# EAGLE design mariokard_v1_JX (EAGLE 7.2.0)
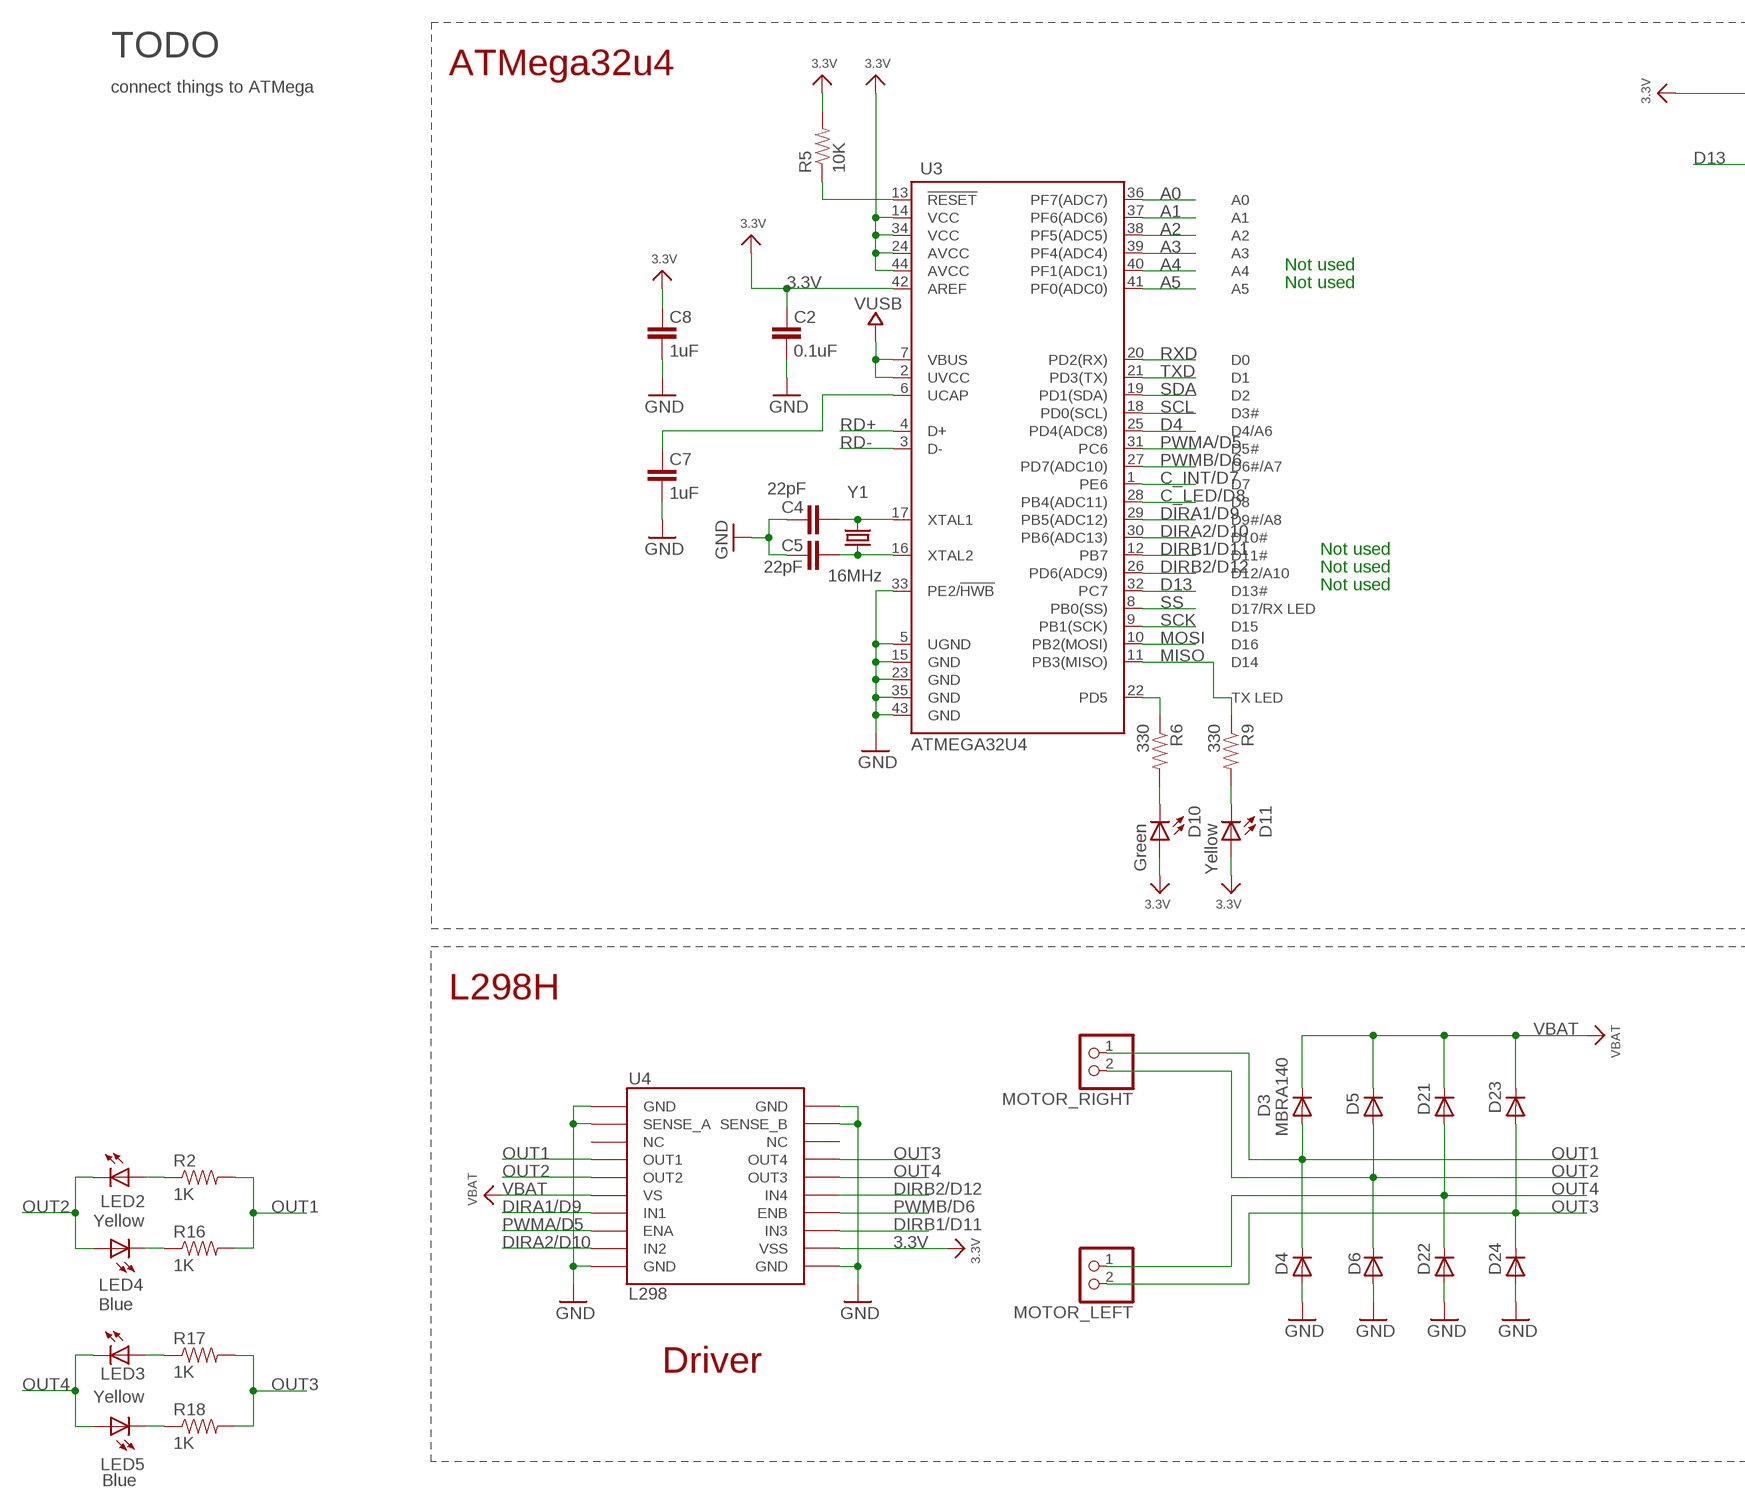
[diagram p0: schematic, sheet 1, part 1 of 2]
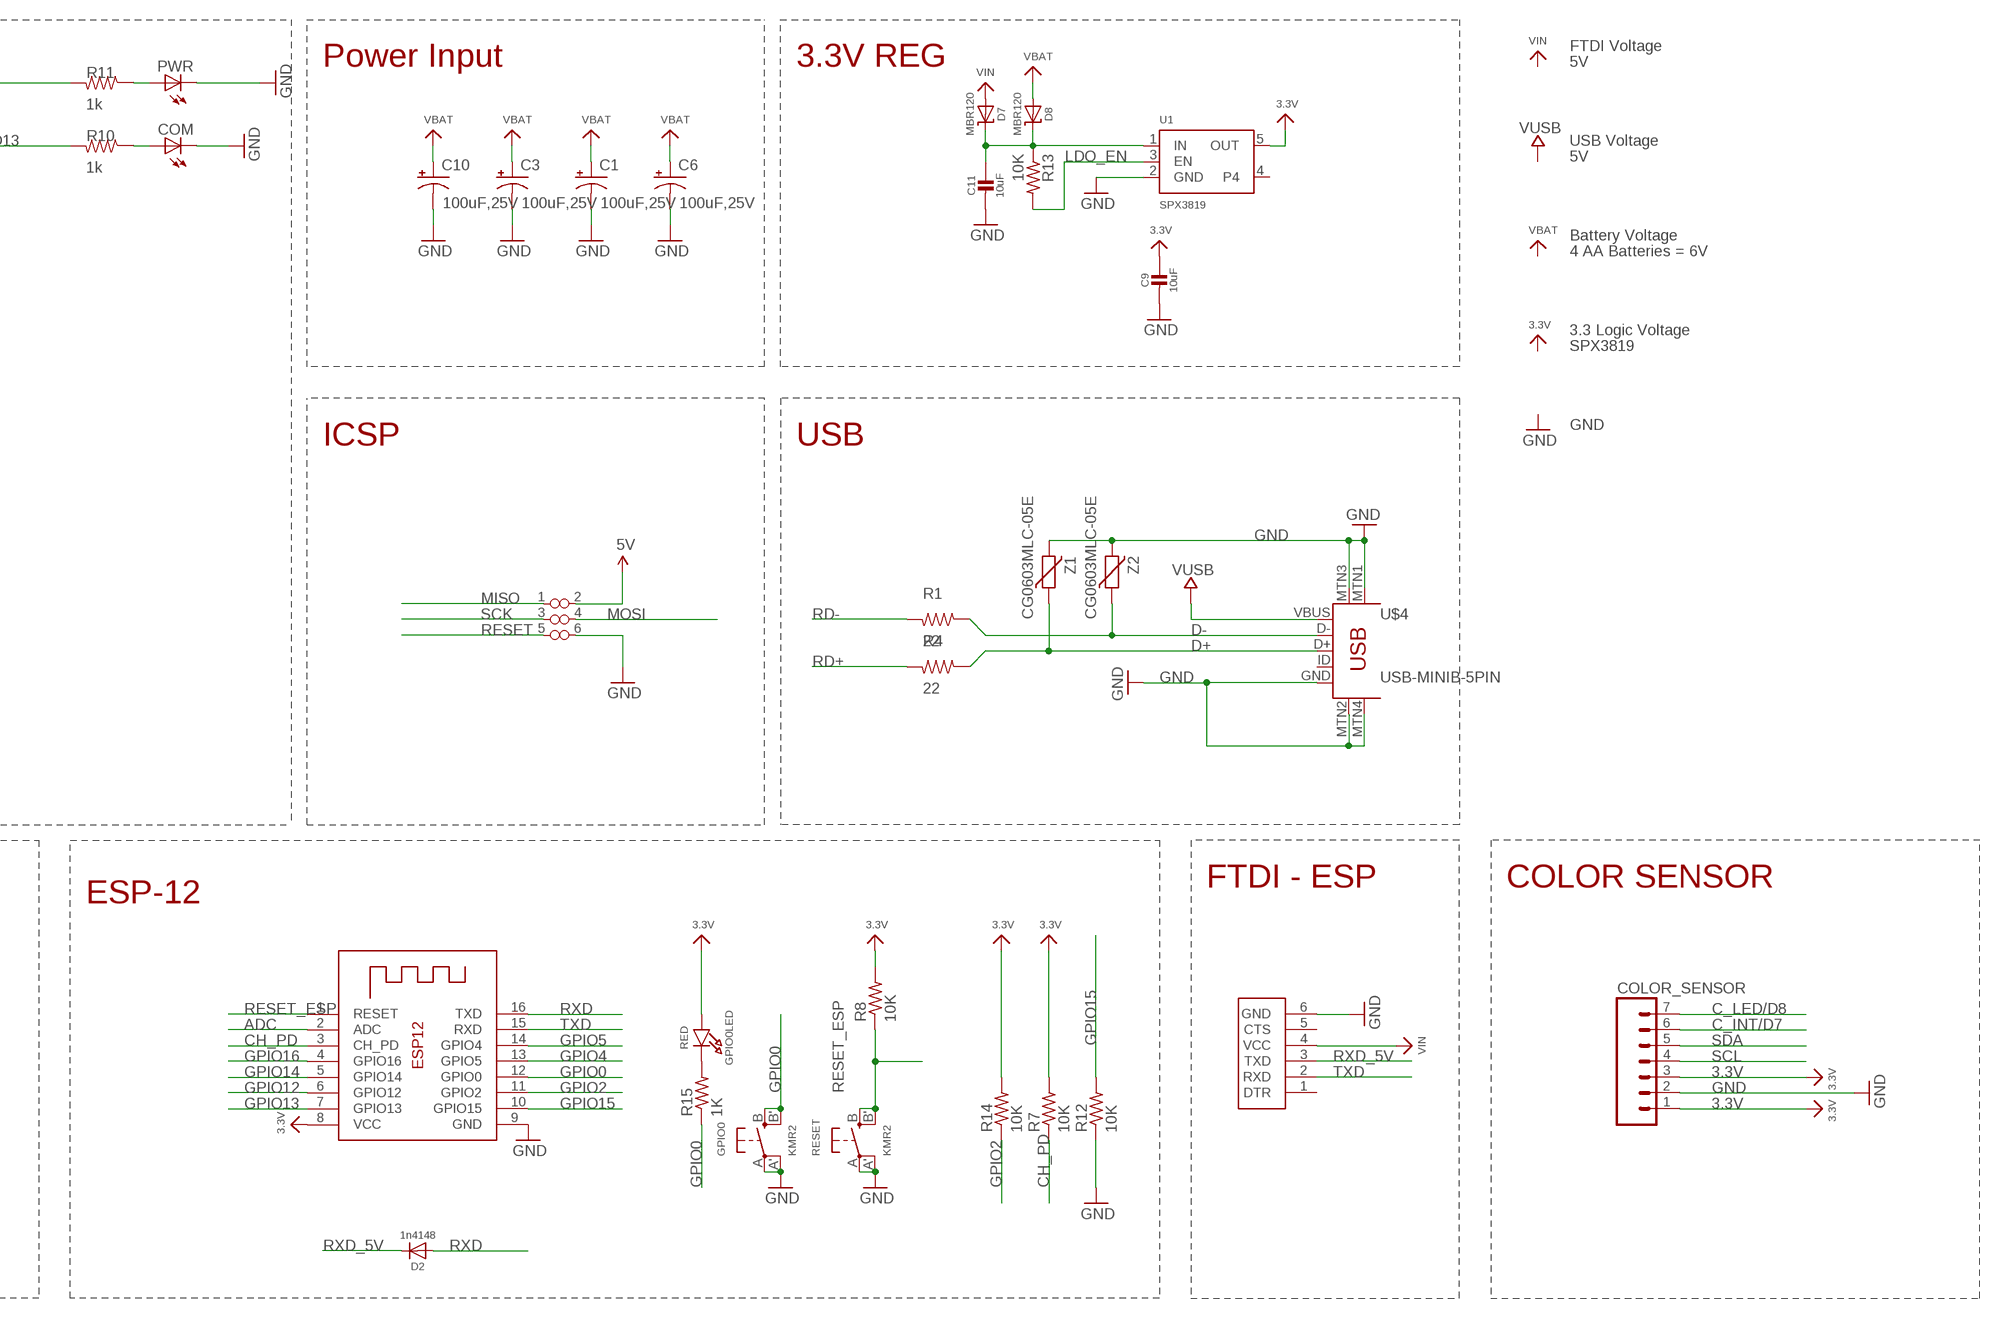
[diagram p1: schematic, sheet 1, part 2 of 2]

## Parts
C1  100uF,25V  CAP_POLF80  [NIPPON_F80]
C2  0.1uF  CAP0603-CAP  [0603-CAP]
C3  100uF,25V  CAP_POLF80  [NIPPON_F80]
C4  22pF  CAP0603-CAP  [0603-CAP]
C5  22pF  CAP0603-CAP  [0603-CAP]
C6  100uF,25V  CAP_POLF80  [NIPPON_F80]
C7  1uF  CAP0603-CAP  [0603-CAP]
C8  1uF  CAP0603-CAP  [0603-CAP]
C9  10uF  CAP_CERAMIC0805-NOOUTLINE  [0805-NO]
C10  100uF,25V  CAP_POLF80  [NIPPON_F80]
C11  10uF  CAP_CERAMIC0805-NOOUTLINE  [0805-NO]
COLOR_SENSOR  M07  [1X07]
COM  LEDCHIPLED_0603  [CHIPLED_0603]
D2  1n4148  DIODESOD-323  [SOD-323]
D3  MBRA140  DIODESMA  [SMA-DIODE]
D4  MBRA140  DIODESMA  [SMA-DIODE]
D5  MBRA140  DIODESMA  [SMA-DIODE]
D6  MBRA140  DIODESMA  [SMA-DIODE]
D7  MBR120  DIODE-SCHOTTKYSOD-123  [SOD-123]
D8  MBR120  DIODE-SCHOTTKYSOD-123  [SOD-123]
D10  Green  LED0603  [LED-0603]
D11  Yellow  LED0603  [LED-0603]
D21  MBRA140  DIODESMA  [SMA-DIODE]
D22  MBRA140  DIODESMA  [SMA-DIODE]
D23  MBRA140  DIODESMA  [SMA-DIODE]
D24  MBRA140  DIODESMA  [SMA-DIODE]
FTDI  FTDI_POGO  [FTDI_POGO]
GPIO0  KMR2  SWITCH_TACT_SMT4.6X2.8  [BTN_KMR2_4.6X2.8]
GPIO0LED  RED  LED0805_NOOUTLINE  [CHIPLED_0805_NOOUTLINE]
ISP  ISP_POGO  [POGO_ISP]
LED2  Yellow  LED0603  [LED-0603]
LED3  Yellow  LED0603  [LED-0603]
LED4  Blue  LED0603  [LED-0603]
LED5  Blue  LED0603  [LED-0603]
MOTOR_LEFT  JST_2PIN-SMT-RA  [JST-PH-2-SMT-RA]
MOTOR_RIGHT  JST_2PIN-SMT-RA  [JST-PH-2-SMT-RA]
PWR  LEDCHIPLED_0603  [CHIPLED_0603]
R1  22  RESISTOR0805-RES  [0805]
R2  1K  RESISTOR0402-RES  [0402-RES]
R4  22  RESISTOR0805-RES  [0805]
R5  10K  RESISTOR0603-RES  [0603-RES]
R6  330  RESISTOR0603-RES  [0603-RES]
R7  10K  R-US_R0603  [R0603]
R8  10K  R-US_R0603  [R0603]
R9  330  RESISTOR0603-RES  [0603-RES]
R10  1k  RESISTOR0805-RES  [0805]
R11  1k  RESISTOR0805-RES  [0805]
R12  10K  R-US_R0603  [R0603]
R13  10K  R-US_R0603  [R0603]
R14  10K  R-US_R0603  [R0603]
R15  1K  R-US_R0603  [R0603]
R16  1K  RESISTOR0402-RES  [0402-RES]
R17  1K  RESISTOR0402-RES  [0402-RES]
R18  1K  RESISTOR0402-RES  [0402-RES]
RESET  KMR2  SWITCH_TACT_SMT4.6X2.8  [BTN_KMR2_4.6X2.8]
U1  SPX3819  VREG_SOT23-5  [SOT23-5]
U3  ATMEGA32U4  ATMEGA32U4TQFP-44  [TQFP44]
U4  L298  L298_BRIDGE_DRIVER  [POWERSO20]
U$4  USB-MINIB-5PIN  [USB-MINIB]
X1  ESP-12  [ESP-12]
Y1  16MHz  CRYSTAL5X3  [CRYSTAL-SMD-5X3]
Z1  CG0603MLC-05E  VARISTORCN0603  [CT/CN0603]
Z2  CG0603MLC-05E  VARISTORCN0603  [CT/CN0603]

## Nets
3.3V: C2.2 C8.2 C9.1 COLOR_SENSOR.1 COLOR_SENSOR.3 D10.A D11.A GPIO0LED.A R5.2 R7.2 R8.2 R11.2 R14.2 U1.5(OUT) U3.14(VCC) U3.24(AVCC) U3.34(VCC) U3.42(AREF) U3.44(AVCC) U4.P$12(VSS) X1.8(VCC)
A0: U3.36(PF7(ADC7))
A1: U3.37(PF6(ADC6))
A2: U3.38(PF5(ADC5))
A3: U3.39(PF4(ADC4))
A4: U3.40(PF1(ADC1))
A5: U3.41(PF0(ADC0))
ADC: X1.2(ADC)
C_INT/D7: COLOR_SENSOR.6 U3.1(PE6)
C_LED/D8: COLOR_SENSOR.7 U3.28(PB4(ADC11))
CH_PD: R7.1 X1.3(CH_PD)
D4: U3.25(PD4(ADC8))
D13: R10.2 U3.32(PC7)
D+: R4.1 U$4.D+ Z1.1
D-: R1.1 U$4.D- Z2.1
DIRA1/D9: U3.29(PB5(ADC12)) U4.P$7(IN1)
DIRA2/D10: U3.30(PB6(ADC13)) U4.P$9(IN2)
DIRB1/D11: U3.12(PB7) U4.P$13(IN3)
DIRB2/D12: U3.26(PD6(ADC9)) U4.P$15(IN4)
GND: C1.- C2.1 C3.- C4.2 C5.2 C6.- C7.1 C8.1 C9.2 C10.- C11.2 COLOR_SENSOR.2 COM.C D4.A D6.A D22.A D24.A FTDI.6(GND) GPIO0.A'(P1) GPIO0.A(P) PWR.C R12.1 RESET.A'(P1) RESET.A(P) U1.2(GND) U3.5(UGND) U3.15(GND) U3.23(GND) U3.33(PE2/!HWB) U3.35(GND) U3.43(GND) U4.P$1(GND) U4.P$2(SENSE_A) U4.P$10(GND) U4.P$11(GND) U4.P$19(SENSE_B) U4.P$20(GND) U$4.GND U$4.MTN1(MTN2) U$4.MTN2(MTN3) U$4.MTN3(MTN1) U$4.MTN4 X1.9(GND) Z1.2 Z2.2
GPIO0: GPIO0.B'(S1) GPIO0.B(S) R15.1 X1.12(GPIO0)
GPIO2: R14.1 X1.11(GPIO2)
GPIO4: X1.13(GPIO5)
GPIO5: X1.14(GPIO4)
GPIO12: X1.6(GPIO12)
GPIO13: X1.7(GPIO13)
GPIO14: X1.5(GPIO14)
GPIO15: R12.2 X1.10(GPIO15)
GPIO16: X1.4(GPIO16)
LDO_EN: R13.2 U1.3(EN)
MISO: ISP.1(MISO) R9.1 U3.11(PB3(MISO))
MOSI: ISP.4(MOSI) U3.10(PB2(MOSI))
N$1: C5.1 U3.16(XTAL2) Y1.1
N$2: C4.1 U3.17(XTAL1) Y1.3
N$3: C7.2 U3.6(UCAP)
N$4: C11.1 D7.C D8.C R13.1 U1.1(IN)
N$5: LED2.A R2.1
N$6: LED4.C R16.1
N$7: LED5.C R18.1
N$8: LED3.A R17.1
N$9: COM.A R10.1
N$10: PWR.A R11.1
N$11: GPIO0LED.C R15.2
N$13: D11.C R9.2
N$14: D10.C R6.2
N$32: ISP.2(VCC) ; supply symbol labelled 5V
N$33: ISP.6(GND) ; supply symbol labelled GND
OUT1: D3.A D4.C MOTOR_RIGHT.1 R2.2 R16.2 U4.P$4(OUT1)
OUT2: D5.A D6.C LED2.C LED4.A MOTOR_RIGHT.2 U4.P$5(OUT2)
OUT3: D23.A D24.C MOTOR_LEFT.2 R17.2 R18.2 U4.P$17(OUT4)
OUT4: D21.A D22.C LED3.C LED5.A MOTOR_LEFT.1 U4.P$16(OUT3)
PWMA/D5: U3.31(PC6) U4.P$8(ENA)
PWMB/D6: U3.27(PD7(ADC10)) U4.P$14(ENB)
RD+: R4.2 U3.4(D+)
RD-: R1.2 U3.3(D-)
RESET: ISP.5(RESET) R5.1 U3.13(!RESET)
RESET_ESP: R8.1 RESET.B'(S1) RESET.B(S) X1.1(RESET)
RXD: D2.A U3.20(PD2(RX)) X1.16(TXD)
RXD_5V: D2.C FTDI.3(TXD)
SCK: ISP.3(SCK) U3.9(PB1(SCK))
SCL: COLOR_SENSOR.4 U3.18(PD0(SCL))
SDA: COLOR_SENSOR.5 U3.19(PD1(SDA))
SS: U3.8(PB0(SS))
TXD: FTDI.2(RXD) U3.21(PD3(TX)) X1.15(RXD)
TXLED1: R6.1 U3.22(PD5)
VBAT: C1.+ C3.+ C6.+ C10.+ D3.C D5.C D8.A D21.C D23.C U4.P$6(VS)
VIN: D7.A FTDI.4(VCC)
VUSB: U3.2(UVCC) U3.7(VBUS) U$4.VBUS
Unconnected: FTDI.1(DTR) FTDI.5(CTS) U1.4 U4.P$3(NC) U4.P$18(NC) U$4.ID

## Notes on the sheet
- TODO | FTDI Voltage
- ATMega32u4 | Power Input | 3.3V REG | 5V
- connect things to ATMega
- USB Voltage
- 5V
- Not used | Battery Voltage
- Not used | 4 AA Batteries = 6V
- 3.3 Logic Voltage
- SPX3819
- GND
- ICSP | USB
- Not used
- Not used
- Not used
- L298H | FTDI - ESP | COLOR SENSOR
- ESP-12
- Driver

## Library data of the parts
C1 C3 C6 C10 = SparkFun:CAP_POL: Capacitor Polarized These are standard SMD and PTH capacitors. Normally 10uF, 47uF, and 100uF in electrolytic and tantalum varieties. Always verify the external diameter of the through hole cap, it varies with capacity, voltage, and manufacturer. The EIA devices should be standard.
C2 C4 C5 C7 C8 = SparkFun:CAP: Capacitor Standard 0603 ceramic capacitor, and 0.1" leaded capacitor.
C9 C11 = microbuilder:CAP_CERAMIC: Ceramic Capacitors For new designs, use the packages preceded by an '_' character since they are more reliable: The following footprints should be used on most boards: _0402 - Standard footprint for regular board layouts _0603 - Standard footprint for regular board layouts _0805 - Standard footprint for regular board layouts _1206 - Standard footprint for regular board layouts For extremely tight-pitch boards where space is at a premium, the following 'micro-pitch' footprints can be used (smaller pads, no silkscreen outline, etc.): _0402MP - Micro-pitch footprint for very dense/compact boards _0603MP - Micro-pitch footprint for very dense/compact boards _0805MP - Micro-pitch footprint for very dense/compact boards _1206MP - Micro-pitch footprint for very dense/compact boards
COLOR_SENSOR = SparkFun-Connectors:M07: Header 7 Standard 7-pin 0.1" header. Use with straight break away headers (SKU : PRT-00116), right angle break away headers (PRT-00553), swiss pins (PRT-00743), machine pins (PRT-00117), and female headers (PRT-00115). NOTES ON THE VARIANTS LOCK and LOCK_LONGPADS... This footprint was designed to help hold the alignment of a through-hole component (i.e. 7-pin header) while soldering it into place. You may notice that each hole has been shifted either up or down by 0.005 of an inch from it's more standard position (which is usually a perfectly straight line). This slight alteration caused the pins (the squares in the middle) to touch the edges of the holes. Because they are alternating, it causes a "brace" to hold the header in place. 0.005 has proven to be the perfect amount of "off-center" position when using our standard breakaway headers. Although looks a little odd when you look at the bare footprint, once you have a header in there, the alteration is very hard to notice. Also, if you push a header all the way into place, it is covered up entirely on the bottom side. This idea of altering the position of holes to aid alignment will be further integrated into the Sparkfun Library for other footprints. It can help hold any component with 3 or more connection pins.
COM PWR = adafruit:LED: LED
D2 = microbuilder:DIODE: Diode
D3-D6 D21-D24 = SparkFun:DIODE: Diode
D7 D8 = microbuilder:DIODE-SCHOTTKY
D10 D11 LED2-LED5 = SparkFun:LED: LEDs Standard schematic elements and footprints for 5mm, 3mm, 1206, and 0603 sized LEDs. 5mm - Spark Fun Electronics SKU : COM-00529 (and others)
FTDI = digikey:FTDI_POGO
GPIO0 RESET = microbuilder:SWITCH_TACT_SMT: SMT Tact Switches 6x6mm - Digikey: P12940SCT-ND KMR2 (4.6x2.8mm) - Digikey: 401-1426-1-ND EVQ-PQHB55 - Light Touch, 160GF (4.5x4.5mm) - Digikey: P8090SCT-ND KMT0 - KMT021 NGJ LHS (etc.) IP68/Waterproof - Digikey: CKN10289CT-ND
GPIO0LED = microbuilder:LED: LED
ISP = digikey:ISP_POGO
MOTOR_LEFT MOTOR_RIGHT = adafruit:JST_2PIN: JST 2-Pin Connectors of various flavors SMT-RA (S2B-PH-SM4) 4UConnector #17311 SMT (B2B-PH-SM4) THM-RA (S2B-PH) THM (B2B-PH)
R1 R4 R10 R11 = SparkFun-Resistors:RESISTOR: Resistor
R2 R5 R6 R9 R16-R18 = SparkFun:RESISTOR: Resistor
R7 R8 R12-R15 = resistor:R-US_: RESISTOR, American symbol
U1 = microbuilder:VREG_SOT23-5: SOT23-5 Fixed Voltage Regulators Part Current Out V Out V In V Dropout θJA (°C/W) TJ (°C) Digikey Part No. ADP121 150mA 3.3V 3.4-5.5V 0.09V @ 150mA -- -- ADP121-AUJZ33R7CT-ND ADP121 150mA 3.0V 3.1-5.5V 0.09V @ 150mA -- -- ADP121-AUJZ30R7CT-ND ADP122 300mA 3.3V 3.4-5.5V 0.085V @ 300mA -- -- ADP122AUJZ-3.3-R7CT-ND ADP1712 300mA 3.3V 3.5-5.5V 0.17V @ 300mA -- -- ADP1712AUJZ-3.3-R7TR-ND AP7311 (Low Cost) 150mA 3.3V 3.5-6V 0.15V @ 150mA -- -- AP7311-33WG-7DICT-ND LD39015M18R 150mA 1.8V 1.9V-5.5V 0.08V @ 100mA -- -- 497-6977-1-ND LP2985A-33DBVR 150mA 3.3V 3.3-16V 0.28V @ 150mA 206 150 296-18479-1-ND MCP1824T-3302E/OT 300mA 3.3V 3.5V-6V 0.2V @ 300mA -- -- MCP1824T-3302E/OTCT-ND MIC5205-2.5YM5 TR 150mA 2.5V 2.7-16V 0.165V @ 150mA -- -- 576-1257-2-ND MIC5205-3.0YM5 TR 150mA 3.0V 3.2V-16V 0.165V @ 150mA -- -- 576-1258-2-ND MIC5205-3.3YM5 TR 150mA 3.3V 3.5V-16V 0.165V @ 150mA -- -- 576-1259-2-ND TPS780330220 150mA 3.3V+2.2V 3.6-5.5V 250mV Max -- -- 296-23332-1-ND TDA3663/N1,135 100mA 3.3V 3.5-45V 0.18V @ 50mA -- -- 568-5343-1-ND Max operating temp can be calculated using θJA, TJ (max junction temperature), and power in watts. Set the "Maximum Ambient Temperature" until it reaches TJ ("Max Junction Temperature"), which is the absolute limit for safe use of the regulator: Heat Sink Temperature Calculator <http://www.daycounter.com/Calculators/Heat-Sink-Temperature-Calculator.phtml> For example, With 12V source into a 3.3V LP2985 and a 30mA load, we are dissipating (12V-3.3V) * 0.03A = 0.261W. With a θJA of 206 °C/W, a TJ of 150°C, and 261mW we can safely use the chip without a heat sink up to 75°C (=147.1°C Junction Temperature).
U3 = SparkFun-DigitalIC:ATMEGA32U4: Atmel 44-pin 8-bit Microcontroller with 32KBytes of ISP Flash and USB Controller
U4 = SparkFun:L298_BRIDGE_DRIVER
U$4 = SparkFun-Connectors:USB-MINIB: Mini-USB "B" connector with 5th pin broken out. Created new symbol breaking out 5th "ID" pin in mini/micro USB connector spec. See: http://en.wikipedia.org/wiki/Mini_usb#Cables. Uses same footprint as 4-pin symbol. Also added pins to connect to mounting / shield pads if required (probably not generally needed as signals aren't shielded once they leave the connector).; PROD_ID: CONN-08193
X1 = microbuilder:ESP-12
Y1 = SparkFun:CRYSTAL: Crystals Various standard crystals. Proven footprints. Spark Fun Electronics SKU : COM-00534
Z1 Z2 = varistor:VARISTOR: VARISTOR

## Board
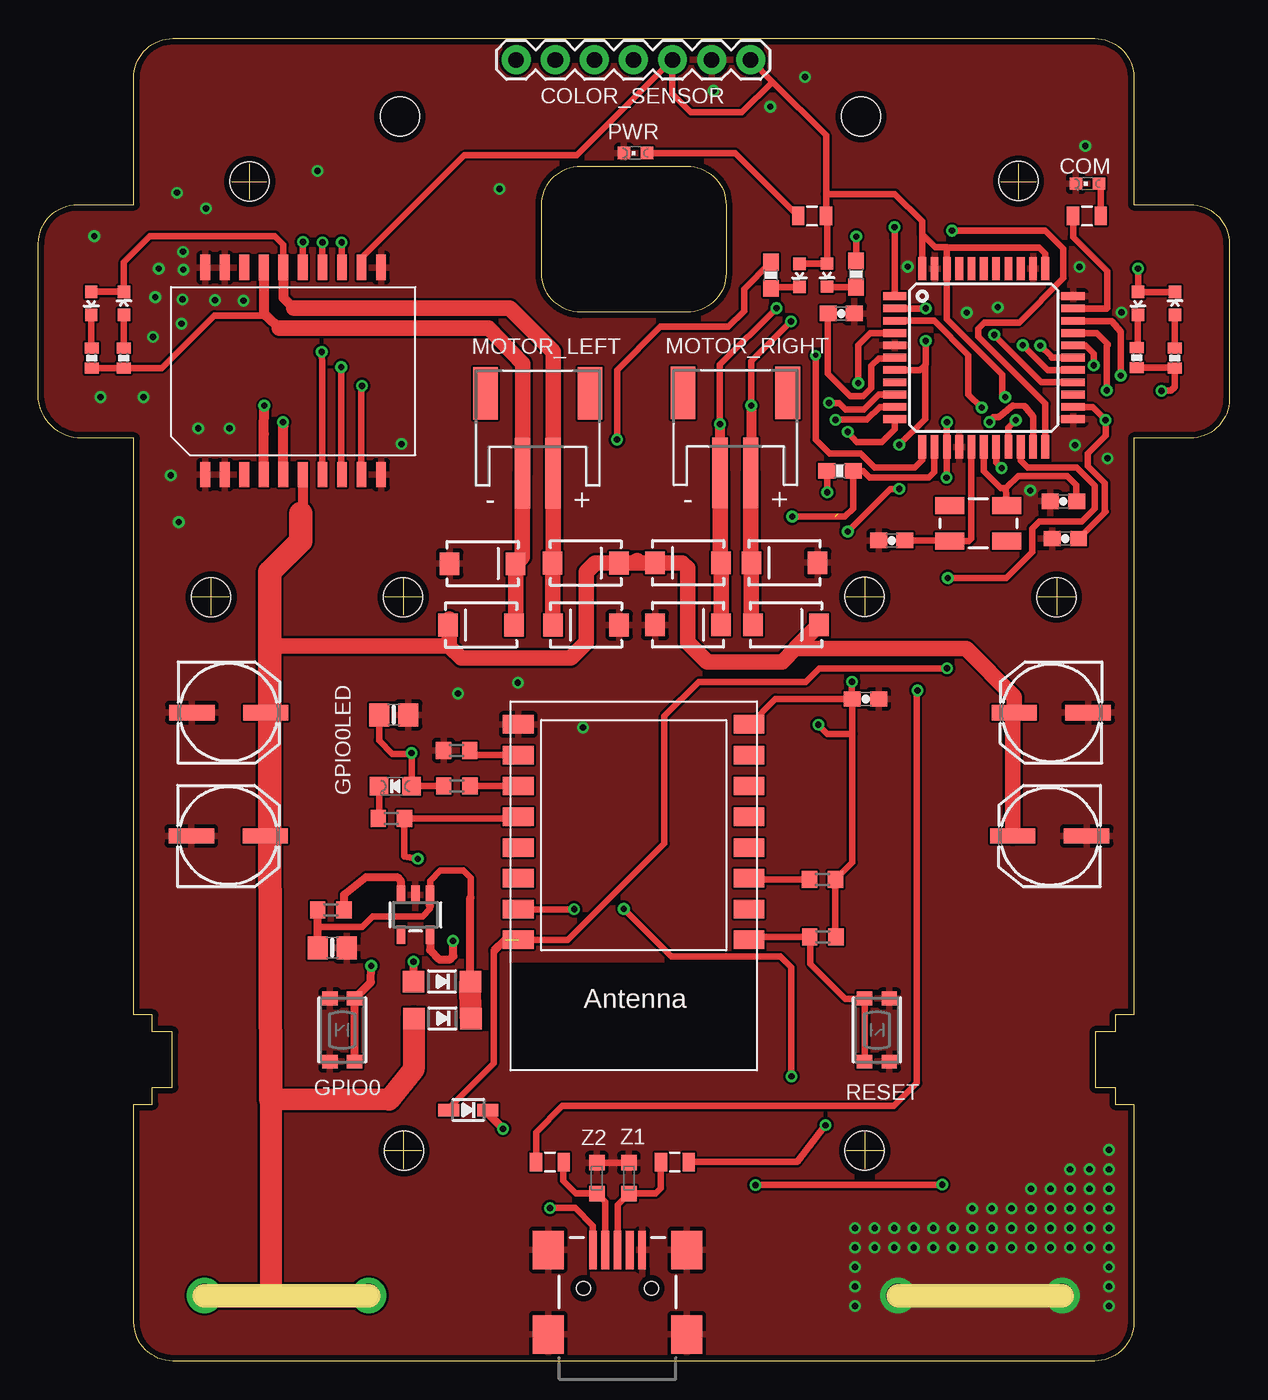
[diagram p2: board, top side]
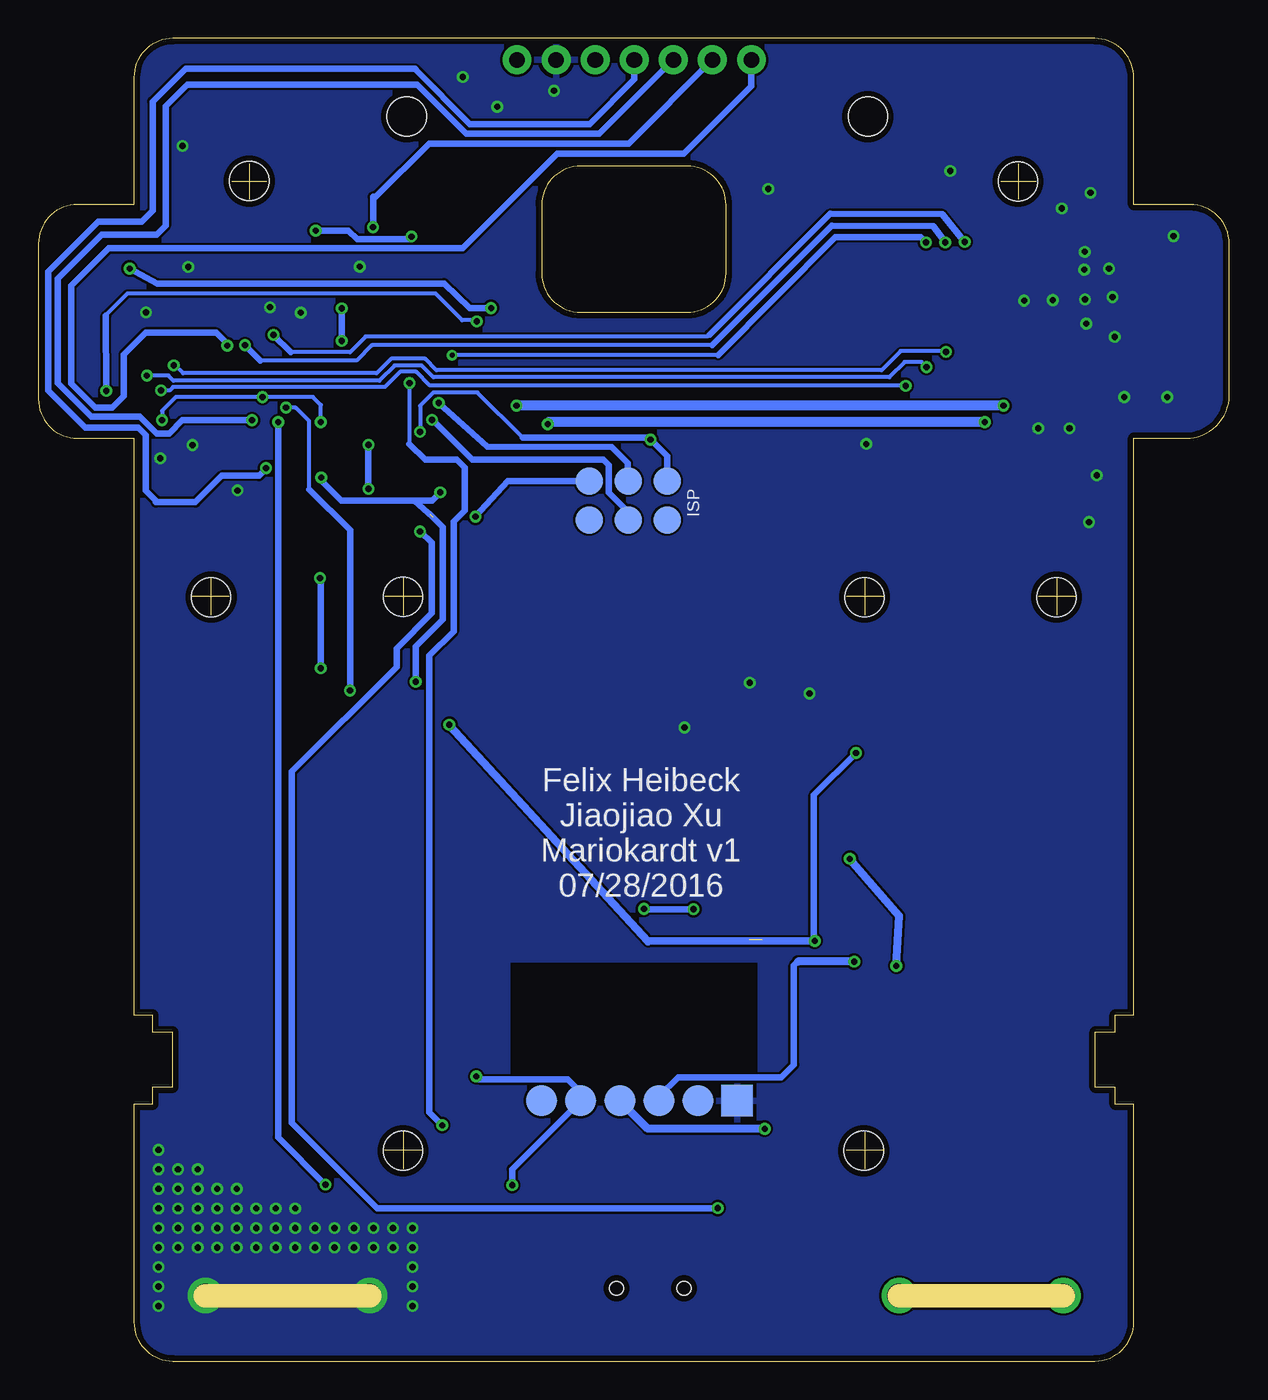
[diagram p3: board, bottom side, seen from below]

Size 77.4 x 86 mm. Coordinates in mm from the lower left corner, seen from the top.
Outline: 22.5,13.7 24.9,13.7
Outline: 23.7,14.9 23.7,12.5
Outline: 52.5,13.7 54.9,13.7
Outline: 53.7,14.9 53.7,12.5
Outline: 10,49.7 12.4,49.7
Outline: 11.2,50.9 11.2,48.5
Outline: 22.5,49.7 24.9,49.7
Outline: 23.7,50.9 23.7,48.5
Outline: 52.5,49.7 54.9,49.7
Outline: 53.7,50.9 53.7,48.5
Outline: 65,49.7 67.4,49.7
Outline: 66.2,50.9 66.2,48.5
Outline: 63.7,77.85 63.7,75.55
Outline: 62.55,76.7 64.85,76.7
Outline: 12.55,76.7 14.85,76.7
Outline: 13.7,77.85 13.7,75.55
Outline: 6.2,75.2 6.2,83.44 arc-90 8.74,86 68.66,86 arc-90 71.2,83.46 71.2,75.2 74.86,75.2 arc-90 77.4,72.66 77.4,62.54 arc-90 74.86,60 71.2,60 71.2,22.5 70,22.5 70,21.4 68.7,21.4 68.7,17.8 70,17.8 70,16.7 71.2,16.7 71.2,2.54 arc-90 68.66,0 8.74,0 arc-90 6.2,2.53 6.2,16.7 7.4,16.7 7.4,17.8 8.7,17.8 8.7,21.4 7.4,21.4 7.4,22.5 6.2,22.5 6.2,60 2.54,60 arc-78 0,62.54 0,72.66 arc-90 2.54,75.2 6.2,75.2
Outline: 44.7,75.16 44.7,70.74 arc-90 42.16,68.2 35.24,68.2 arc-90 32.7,70.74 32.7,75.16 arc-90 35.24,77.7 42.16,77.7 arc-90 44.7,75.16
Copper layers (1*16): Top 0.0356mm / dielectric 1.5011mm / Bottom 0.0356mm
Design rules "oshpark-2layer *": minimum track width 6mil, minimum drill 13mil, track to track 6mil, track to pad 6mil, pad to pad 6mil, via to via 6mil, smd to smd 6mil, copper to edge 15mil, drill to drill 6mil, minimum pad ring 7mil, minimum via ring 7mil, stop-mask expansion 2.5mil, vias tented up to drill 16mil, thermal gap 10mil
Holes 2.54 mm at 13.73,76.71 63.7,76.72 11.23,49.67 23.7,49.67 66.18,49.67 53.7,49.7 53.7,13.68 23.75,13.68 23.49,80.92 53.46,80.92
Milling: 2 lines

### Footprints (pad centres in the part's own frame; a part is rotated, then mirrored left to right if it is on the bottom)
NIPPON_F80 = smd 2.95 x 1: + 2.4,0; - -2.4,0
0603-CAP = smd 1.1 x 1: 1 -0.85,0; 2 0.85,0
0805-NO = smd 1.3 x 1.5: 1 -0.95,0; 2 0.95,0
1X07 = drill 1.016 pad 1.88: 1 0,0; 2 2.54,0; 3 5.08,0; 4 7.62,0; 5 10.16,0; 6 12.7,0; 7 15.24,0
CHIPLED_0603 = smd 0.8 x 0.8: A 0,-0.75; C 0,0.75
SOD-323 = smd 1.35 x 0.8: A 1.27,0; C -1.27,0
SMA-DIODE = smd 1.27 x 1.47: A -2.15,0; C 2.15,0
SOD-123 = smd 1.4 x 1.4: A 1.85,0; C -1.85,0
LED-0603 = smd 0.8 x 0.8: A 0,-0.75; C 0,0.75
FTDI_POGO = smd 2.032 x 2.032: 1 -6.35,0; 2 -3.81,0; 3 -1.27,0; 4 1.27,0; 5 3.81,0; 6 6.35,0
BTN_KMR2_4.6X2.8 = smd 0.9 x 1: A 2.05,0.8; A' -2.05,0.8; B 2.05,-0.8; B' -2.05,-0.8
CHIPLED_0805_NOOUTLINE = smd 1.2 x 1.2: A 0,-1.05; C 0,1.05
POGO_ISP = smd 1.778 x 1.778: 1 -1.27,2.54; 2 1.27,2.54; 3 -1.27,0; 4 1.27,0; 5 -1.27,-2.54; 6 1.27,-2.54
JST-PH-2-SMT-RA = smd 1 x 4.6: 1 1,-3.7; 2 -1,-3.7 | smd 1.6 x 3.4: NC1 -3.4,1.5; NC2 3.4,1.5
0805 = smd 0.8 x 1.2: 1 -0.9,0; 2 0.9,0
0402-RES = smd 0.7 x 0.9: 1 -0.65,0; 2 0.65,0
0603-RES = smd 1.1 x 1: 1 -0.85,0; 2 0.85,0
R0603 = smd 1 x 1.1: 1 -0.85,0; 2 0.85,0
SOT23-5 = smd 0.55 x 1.2: 1 -0.95,-1.3; 2 0,-1.3; 3 0.95,-1.3; 4 0.95,1.3; 5 -0.95,1.3
TQFP44 = smd 1.5 x 0.5: 1 -5.8,4; 2 -5.8,3.2; 3 -5.8,2.4; 4 -5.8,1.6; 5 -5.8,0.8; 6 -5.8,0; 7 -5.8,-0.8; 8 -5.8,-1.6; 9 -5.8,-2.4; 10 -5.8,-3.2; 11 -5.8,-4; 23 5.8,-4; 24 5.8,-3.2; 25 5.8,-2.4; 26 5.8,-1.6; 27 5.8,-0.8; 28 5.8,0; 29 5.8,0.8; 30 5.8,1.6; 31 5.8,2.4; 32 5.8,3.2; 33 5.8,4 | smd 0.5 x 1.5: 12 -4,-5.8; 13 -3.2,-5.8; 14 -2.4,-5.8; 15 -1.6,-5.8; 16 -0.8,-5.8; 17 0,-5.8; 18 0.8,-5.8; 19 1.6,-5.8; 20 2.4,-5.8; 21 3.2,-5.8; 22 4,-5.8; 34 4,5.8; 35 3.2,5.8; 36 2.4,5.8; 37 1.6,5.8; 38 0.8,5.8; 39 0,5.8; 40 -0.8,5.8; 41 -1.6,5.8; 42 -2.4,5.8; 43 -3.2,5.8; 44 -4,5.8
POWERSO20 = smd 1.651 x 0.635: P$1 -6.731,5.715; P$2 -6.731,4.445; P$3 -6.731,3.175; P$4 -6.731,1.905; P$5 -6.731,0.635; P$6 -6.731,-0.635; P$7 -6.731,-1.905; P$8 -6.731,-3.175; P$9 -6.731,-4.445; P$10 -6.731,-5.715; P$11 6.731,-5.715; P$12 6.731,-4.445; P$13 6.731,-3.175; P$14 6.731,-1.905; P$15 6.731,-0.635; P$16 6.731,0.635; P$17 6.731,1.905; P$18 6.731,3.175; P$19 6.731,4.445; P$20 6.731,5.715
USB-MINIB = smd 2.5 x 0.5: D+ 2.5,0; D- 2.5,0.8; GND 2.5,-1.6; ID 2.5,-0.8; VBUS 2.5,1.6 | smd 2.5 x 2: MTN1 -3,4.5; MTN2 2.5,4.5; MTN3 -3,-4.5; MTN4 2.5,-4.5 | hole 0.9: 0,2.2; 0,-2.2
ESP-12 = smd 2 x 1.2: 1 -7.5,4.5; 2 -7.5,2.5; 3 -7.5,0.5; 4 -7.5,-1.5; 5 -7.5,-3.5; 6 -7.5,-5.5; 7 -7.5,-7.5; 8 -7.5,-9.5; 9 7.5,-9.5; 10 7.5,-7.5; 11 7.5,-5.5; 12 7.5,-3.5; 13 7.5,-1.5; 14 7.5,0.5; 15 7.5,2.5; 16 7.5,4.5
CRYSTAL-SMD-5X3 = smd 1.9 x 1.1: 1 -1.85,-1.15; 2 1.85,-1.15; 3 1.85,1.15; 4 -1.85,1.15
CT/CN0603 = smd 1 x 1: 1 -1,0; 2 1,0

### Placement (x,y rotation side)
C1  12.34,34.14 0 top
C2  53.76,43.05 180 top
C3  65.83,42.17 180 top
C4  66.63,55.9 180 top
C5  55.47,53.36 180 top
C6  12.37,42.17 0 top
C7  52.19,68.12 180 top
C8  66.75,53.48 0 top
C9  23.09,42.02 0 top
C10  65.73,34.14 180 top
C11  19.09,26.88 0 top
COLOR_SENSOR  46.29,84.61 180 top
COM  68.19,76.56 90 top
D2  27.94,16.32 180 top
D3  48.6,47.88 0 top
D4  48.49,51.91 180 top
D5  42.23,51.9 180 top
D6  42.23,47.87 0 top
D7  26.23,24.68 180 top
D8  26.26,22.28 180 top
D10  51.26,70.61 180 top
D11  49.47,70.59 180 top
D21  35.57,51.89 0 top
D22  35.6,47.86 180 top
D23  28.77,47.86 180 top
D24  28.87,51.85 0 top
FTDI  38.34,16.93 0 bottom
GPIO0  19.75,21.52 90 top
GPIO0LED  23.19,37.39 90 top
ISP  39.07,55.96 270 bottom
LED2  73.87,68.77 0 top
LED3  5.55,68.78 0 top
LED4  71.47,68.78 180 top
LED5  3.43,68.78 180 top
MOTOR_LEFT  32.45,61.42 0 top
MOTOR_RIGHT  45.3,61.45 0 top
PWR  38.81,78.55 90 top
R1  33.25,12.93 180 top
R2  73.87,65.21 270 top
R4  41.37,12.94 0 top
R5  52.1,57.88 180 top
R6  53.15,70.68 270 top
R7  50.96,31.33 0 top
R8  50.98,27.57 0 top
R9  47.61,70.6 270 top
R10  68.15,74.47 180 top
R11  50.29,74.45 0 top
R12  27.18,39.71 0 top
R13  19,29.35 0 top
R14  27.19,37.38 180 top
R15  22.93,35.29 180 top
R16  71.4,65.24 270 top
R17  5.55,65.21 270 top
R18  3.47,65.21 270 top
RESET  54.5,21.52 270 top
U1  24.5,29.02 180 top
U3  61.45,65.25 0 top
U4  16.55,64.37 90 top
U$4  37.64,4.73 90 top
X1  38.69,31.89 180 top
Y1  61.09,54.47 0 top
Z1  38.38,11.9 90 top
Z2  36.3,11.9 90 top

### Tracks (layer width: path | path; a pad name or v marks a point on that pad's centre or on a via)
3.3V  (via drill 0.41)  (1 unrouted)
  Top 0.406: 26.36,37.46 26.34,37.44 R14.2 GPIO0LED.A 24.25,37.4 v24.25,39.54 24.2,39.49 23.01,39.49 22.14,40.36 C9.1 | R5.2 51.28,57.85 v51.28,56.48 | v59.03,57.45 59.05,57.47 U3.14 v59.05,61.05 | C8.2 69.36,55.24 69.31,55.29 69.31,57.09 68.19,58.21 68.19,59 69.36,60.16 v69.36,61.18 68.52,62.02 67.27,62.02 U3.24 | R11.2 51.25,74.52 | 57.45,73.28 U3.44 | R11.2 51.26,74.38 D10.A 49.5,71.36 D11.A | R8.2 51.81,27.59 R7.2 52.91,32.43 52.91,40.78 | U3.24 | C2.2 52.87,43.05 52.88,43.05 v52.88,44.16 | 59.05,72.43 U3.42 59.03,71.02 59.03,67.76 62.66,64.13 62.66,62.86 v62.84,62.68 | 59.05,72.43 58.29,72.43 57.45,73.28 | U3.34 65.45,72.01 65.04,72.41 59.08,72.41 59.05,72.43 | 51.2,75.89 51.2,79.7 47.74,83.16 | 51.2,75.89 51.2,74.46 R11.2 | 57.45,73.28 57.45,74.11 55.67,75.89 51.2,75.89 | 52.91,40.78 C2.2 | 46.22,41.37 47.9,43.05 C2.2 | v50.69,41.37 51.28,40.78 52.91,40.78 | COLOR_SENSOR.1 47.74,83.16 | 47.74,83.16 47.68,83.16 45.73,81.2 42.41,81.2 41.2,82.41 41.2,84.56 41.23,84.59 COLOR_SENSOR.3 35,78.39 27.69,78.39 21,71.7 U4.P$12
  Top 0.508: U1.5 25.45,26.71 26.03,26.13 26.77,26.13 26.97,26.33 26.97,27.3 v26.94,27.32 | 46.22,41.37 X1.8
  Bottom 0.254: v59.05,61.05 59.05,62.17 59.56,62.68 v62.84,62.68 68.47,62.68 69.36,61.79 v69.36,61.18
  Bottom 0.406: 27,27.32 27,36.8 v24.25,39.54 | v51.28,56.48 51.81,55.95 52.98,55.95 | 52.98,55.95 57.73,55.95 59.03,57.24 v59.03,57.45 | 51.76,54.88 52.98,55.95 | v52.88,44.16 52.88,46.45 51.13,48.2 51.13,54.22 51.97,55.06
  Bottom 0.508: v26.94,27.32 27,27.32 37.77,27.27 v50.69,41.37
C_INT/D7  (via drill 0.41)
  Top 0.406: v55.65,73.73 55.65,73.07 U3.1
  Bottom 0.406: v55.65,73.73 55.65,75.71 55.47,75.71 52.01,79.17 39.04,79.17 COLOR_SENSOR.6
C_LED/D8  (via drill 0.41)
  Top 0.406: U3.28 65.86,65.24 65.86,65.3 v65.12,66.03
  Bottom 0.406: v65.12,66.03 65.12,66.16 65.83,66.87 70.43,66.87 71.85,65.45 71.85,62.76 72.61,61.99 73.71,61.99 75.26,63.54 75.26,69.92 72.82,72.36 49.83,72.36 43.69,78.5 35.46,78.5 31.05,82.91 COLOR_SENSOR.7
CH_PD
  Top 0.406: X1.3 46.26,31.33 R7.1
D13
  Top 0.406: R10.2 67.25,73.09 69.46,70.88 69.46,68.47 69.44,68.44 U3.32
D+
  Top 0.406: U$4.D+ 37.64,10.16 Z1.1 40.11,10.9 40.46,11.24 R4.1
D-
  Top 0.406: U$4.D- 36.84,10.36 Z2.1 34.93,10.9 34.11,11.73 34.11,12.88 R1.1
DIRA1/D9  (via drill 0.41)
  Top 0.406: U4.P$7 18.46,64.66 v18.41,65.63 | v68.6,64.74 68.6,65.5 68.07,66.03 U3.29
  Bottom 0.254: v18.41,65.63 18.46,65.68 21.36,65.68 22.6,64.43 51.53,64.43 52.27,65.17 54.48,65.17 55.42,64.23 67.99,64.23 68.5,64.74 v68.6,64.74
DIRA2/D10  (via drill 0.41)
  Top 0.406: U4.P$9 21,63.13 v21.03,63.42 | v69.44,63.11 69.44,65.98 69.52,66.06 69.52,66.11 68.78,66.85 U3.30
  Bottom 0.254: v21.03,63.42 21.05,63.44 51.96,63.44 52.85,64.33 53.89,64.33 54.88,63.34 68.65,63.34 68.88,63.11 v69.44,63.11
DIRB1/D11  (via drill 0.33, 0.41)
  Top 0.406: U4.P$13 19.71,71.12 v19.71,72.74 | v50.52,65.4 50.52,59.91 51.43,59 53.46,59 54.35,58.11 56.97,58.11 57.45,58.59 U3.12
  Bottom 0.254: 33.22,65.42 33.24,65.4 v50.52,65.4
  Bottom 0.406: v19.71,72.74 20.04,73.07 25.6,73.07 33.22,65.42
DIRB2/D12  (via drill 0.41)
  Top 0.406: U4.P$15 17.17,71.12 v17.19,72.76 | U3.26 65.2,63.64 v62.12,66.72
  Bottom 0.254: 33.78,66.74 33.9,66.62 56.13,66.62 57.15,65.6 61.01,65.6
  Bottom 0.406: v17.19,72.76 18.64,74.57 25.93,74.59 33.78,66.74 | 62.1,66.74 v62.12,66.72 | 61.92,66.51 v62.12,66.72 | 61.01,65.6 v62.12,66.72
GND  (via drill 0.41, 1.52)
  Top 0.406: Z2.2 Z1.2
  Top 1.524: v55.88,4.26 v66.54,4.26
  Bottom 1.524: v66.54,4.26 v55.88,4.26
  other vias: 9.01,75.96 68.04,79.01 60.35,68.17 70.4,68.19 67.66,71.14 56.51,71.16 7.82,71.04 9.39,72.13 9.42,70.96 9.37,69.03 13.33,68.95 11.48,68.98 9.29,67.45 7.59,69.18 7.44,66.59 10.89,74.95 3.63,73.14 18.13,77.39 29.97,76.22 31.16,44.11 35.4,41.19 64.46,56.61 67.38,59.56 69.49,58.69 62.35,68.52 69.59,8.65 68.32,8.65 67.05,8.65 65.78,8.65 63.24,7.38 60.7,7.38 59.43,7.38 58.16,7.38 56.89,8.65 55.62,7.38 55.62,8.65 54.35,8.65 54.35,7.38 69.59,7.38 69.59,6.11 69.59,3.57 53.08,8.65 53.08,7.38 53.08,6.11 53.08,4.84 69.59,9.92 68.32,9.92 67.05,9.92 65.78,9.92 63.24,8.65 61.97,8.65 60.7,8.65 59.43,8.65 58.16,8.65 56.89,7.38 69.59,11.19 67.05,11.19 65.78,11.19 63.24,9.92 60.7,9.92 61.97,7.38 53.08,3.57 69.59,13.73 61.97,9.92 64.51,8.65 64.51,11.19 67.05,12.46 68.32,12.46 69.59,12.46 64.51,7.38 64.51,9.92 65.78,7.38 67.05,7.38 68.32,7.38 43.88,82.6 47.57,81.56 49.83,83.5 68.32,11.19 69.59,4.84 6.83,62.68 4.03,62.68 8.61,57.6 10.38,60.65 12.42,60.65 9.11,54.55 23.59,59.63 27.28,43.4
  pour Top: -5.29,96.77 86.66,96.77 86.66,-15.5 -5.29,-15.5
  pour Bottom: -3.41,92.91 82.7,92.91 82.7,-9.35 -3.41,-9.35
GPIO0  (via drill 0.41)
  Top 0.406: X1.12 31.08,35.29 R15.1 23.78,32.82 v24.66,32.66
  Top 0.508: GPIO0.B' GPIO0.B 21.61,24.63 v21.64,25.7
  Bottom 0.508: v21.64,25.7 21.46,28.95 v24.66,32.66
GPIO2
  Top 0.406: R14.1 X1.11
GPIO15
  Top 0.406: X1.10 28.09,39.39 R12.2
LDO_EN
  Top 0.508: R13.2 19.86,30.33 21.31,31.46 23.31,31.46 23.54,31.23 U1.3
MISO  (via drill 0.41)
  Top 0.406: v37.61,59.91 37.61,64.43 40.43,67.25 44.85,67.25 45.87,68.27 45.87,69.71 R9.1 | U3.11 55.65,60.6 54.81,59.76 53.18,59.76 v52.6,60.42
  Bottom 0.254: v52.6,60.42 52.6,62.12 51.74,62.98 48.87,62.98 45.92,60.04
  Bottom 0.406: ISP.1 36.53,58.83 v37.61,59.91 37.74,60.04 45.92,60.04
MOSI  (via drill 0.41)
  Top 0.406: v51.81,61.21 53.84,61.21 54.68,62.04 U3.10 | U3.10
  Bottom 0.406: ISP.4 39.07,55.2 40.33,56.46 40.33,58.26 40.69,58.62 49.2,58.62 v51.81,61.21
N$1
  Top 0.406: C5.1 59.2,53.36 Y1.1 59.25,53.31 60.47,53.31 60.65,53.48 U3.16
N$2
  Top 0.406: C4.1 67.46,55.92 67.46,56.96 66.87,57.55 63.67,57.55 62.89,56.76 | 62.89,56.76 Y1.3 | U3.17 61.44,57.88 62.55,56.76 62.89,56.76
N$3
  Top 0.406: U3.6 55.59,65.19 54.61,65.19 54.12,64.71 54.12,63.26 53.61,62.76 52.75,62.76 51.3,64.2 51.3,68.08 C7.2
N$4
  Top 0.406: U1.1 25.45,31.21 26.13,31.89 27.61,31.89 28.09,31.41 28.09,30.14 28.08,30.13 | R13.1 18.13,29.33 18.13,28.24 21.05,28.24 21.74,28.92 24.96,28.92 25.45,29.41 25.45,29.58
  Top 0.508: D7.C 28.08,30.13 | C11.1 18.14,29.34 R13.1 | 25.45,29.58 U1.1
  Top 1.422: D8.C 28.11,22.34 D7.C
N$5
  Top 0.406: R2.1 LED2.A
N$6
  Top 0.406: R16.1 71.47,65.89 LED4.C
N$7
  Top 0.406: R18.1 3.43,65.91 LED5.C
N$8
  Top 0.406: R17.1 5.55,66.27 LED3.A
N$9
  Top 0.406: COM.A 69.05,76.56 R10.1
N$10
  Top 0.406: R11.1 45.29,78.55 PWR.A
N$11
  Top 0.406: GPIO0LED.C 22.14,35.34 R15.2
N$13
  Top 0.406: R9.2 47.7,69.84 D11.C
N$14
  Top 0.406: D10.C 51.28,69.83 R6.2
OUT1  (via drill 0.41)
  Top 0.406: R16.2 73.87,64.59 R2.2 73.86,63.34 73.6,63.09 v73,63.09 | v46.33,62.12 46.33,65.02 v48.92,67.61
  Top 0.635: U4.P$4 14.65,60.29 v14.68,62.12 | v46.33,62.12 MOTOR_RIGHT.1
  Top 1.016: 46.33,51.92 D4.C | D4.C 46.34,47.98 D3.A | MOTOR_RIGHT.1 46.3,51.95 D4.C
  Bottom 0.254: v48.92,67.61 48.99,67.68 49.86,67.68 51.58,69.41 71.62,69.41 73.02,68.01 73.02,67.96
  Bottom 0.406: v73,63.09 73.02,67.96
  Bottom 0.635: v14.68,62.12 v46.33,62.12
OUT2  (via drill 0.41)
  Top 0.406: LED2.C 71.47,69.52 | 71.47,69.52 LED4.A | 71.47,69.52 v71.47,71.04 | v44.29,60.93 44.29,64.79 v47.98,68.47
  Top 0.635: U4.P$5 15.92,60.82 v15.9,61.05 | v44.29,60.93 MOTOR_RIGHT.2
  Top 1.016: 44.33,51.95 D5.A | D5.A D6.C | MOTOR_RIGHT.2 44.3,51.98 D5.A
  Bottom 0.406: v71.47,71.04 69.67,70.07 51.02,70.07 49.37,68.47 v47.98,68.47
  Bottom 0.635: v15.9,61.05 44.22,61.05 v44.29,60.93
OUT3
  Top 0.406: 14.8,67.98 11.44,67.98 8.03,64.56 R17.2 R18.2
  Top 0.635: U4.P$17 14.65,68.12 14.8,67.98 15.67,67.15
  Top 1.016: 31.45,52.28 D24.C | D24.C 31.02,48.27 D23.A | D24.C 31.45,52.28 MOTOR_LEFT.2 31.49,57.75 31.49,64.86 29.26,67.15 15.67,67.15
OUT4
  Top 0.406: U4.P$16 15.92,72.59 15.36,73.14 7.23,73.14 5.55,71.46 LED3.C LED5.A
  Top 0.635: U4.P$16 15.92,69.14 16.58,68.47
  Top 1.016: 33.45,51.92 D21.A | D21.A 33.42,48.27 D22.C | D21.A 33.45,51.92 MOTOR_LEFT.1 33.47,57.74 33.47,65.63 30.63,68.47 16.58,68.47
PWMA/D5  (via drill 0.41)
  Top 0.254: U4.P$8 19.71,57.66
  Top 0.406: v70.35,64.08 70.35,66.92 69.77,67.61 67.28,67.61 U3.31 | 19.71,57.66 19.68,57.69 v19.68,64.64
  Bottom 0.254: v19.68,64.64 20.01,64.97 21.1,64.97 22.09,63.97 51.74,63.97 52.5,64.74 54.25,64.74 55.24,63.75 68.63,63.75 68.96,64.08 v70.35,64.08
PWMB/D6  (via drill 0.41)
  Top 0.406: U4.P$14 v18.46,72.74 | U3.27 65.59,64.44 v63.98,66.06
  Bottom 0.254: 33.6,66.06 55.72,66.06 56.71,65.07 62.99,65.07
  Bottom 0.406: v18.46,72.74 19.22,73.8 25.83,73.83 33.6,66.06 | 62.99,65.07 v63.98,66.06
RD+  (via drill 0.41)
  Top 0.406: R4.2 49.32,12.94 v51.15,15.33 | U3.4 54.07,66.85 53.28,66.06 v53.28,63.59
  Bottom 0.254: v53.28,63.59 53.28,59.63
  Bottom 0.406: v51.15,15.33 51.99,16.17 51.99,45.86 50.41,47.44 50.41,54.58 49.7,55.29 49.7,58.11 50.21,58.62 52.27,58.62 53.28,59.63
RD-  (via drill 0.41)
  Top 0.406: R1.2 32.35,14.87 34.06,16.58 55.6,16.58 57.09,18.08 57.09,43.55 v57.15,43.6 | U3.3 55.66,67.66 58.21,67.66 60.45,65.42 60.45,62.86 v61.31,61.99
  Bottom 0.254: 59.79,56.66 59.81,56.69 59.81,61.13 60.68,61.99 v61.31,61.99
  Bottom 0.406: v57.15,43.6 57.15,54.02 59.79,56.66
RESET  (via drill 0.41)
  Top 0.406: v48.99,54.91 52.42,54.91 52.95,55.44 R5.1 53.61,57.88 54.05,57.45 57.88,57.45 58.24,57.8 58.24,59.44 U3.13
  Bottom 0.406: ISP.5 46.9,57.23 v48.99,54.91
RESET_ESP
  Top 0.406: X1.1 46.37,27.57 R8.1 50.18,27.52 50.18,25.83 52.45,23.56 53.57,23.56 RESET.B' RESET.B
RXD  (via drill 0.41)  (1 unrouted)
  Top 0.406: X1.16 31.21,27.37 34.41,27.37 40.69,33.65 40.69,41.93 42.92,44.16 49.88,44.16 50.74,45.03 59.03,45.03 v59.05,45.05 | 29.64,26.69 29.59,26.64 29.59,19.35 26.67,16.43 D2.A | v59.1,50.92 62.91,50.92 64.59,52.6 64.59,54.15 65.04,54.6 67.81,54.6 68.65,55.44 68.65,56.94 67.48,58.11 64.31,58.11 63.85,58.56 U3.20
  Top 0.508: 29.64,26.69 30.35,27.4
  Bottom 0.406: v59.05,45.05 59.05,50.87 v59.1,50.92
RXD_5V  (via drill 0.41)
  Top 0.508: D2.C 29.21,16.09 v30.2,15.11
  Bottom 0.508: v30.2,15.11 37.78,15.11 FTDI.3
SCK  (via drill 0.41)
  Top 0.406: U3.9 55.63,62.86 54.63,62.86 53.64,61.87 52.47,61.87 52.04,62.3 v51.38,62.3
  Bottom 0.406: ISP.3 39.1,58.4 40.13,59.43 48.23,59.45 v51.38,62.3
SCL  (via drill 0.41)
  Top 0.406: U3.18 62.25,58.42 v62.61,58.06
  Bottom 0.406: v62.61,58.06 62.61,58.03 63.06,57.57 65.48,57.57 67.2,55.85 69.77,55.85 69.77,55.96 70.41,56.6 70.41,60.21 70.91,60.71 74.37,60.71 76.76,63.1 76.76,70.83 73.5,74.09 70.7,74.09 69.98,74.81 69.98,81.89 67.84,84.02 52.92,84.02 52.92,84.01 49.35,80.44 41.58,80.44 38.67,83.35 COLOR_SENSOR.4
SDA  (via drill 0.41)
  Top 0.406: U3.19 63.04,59.45 63.04,60.7 v63.52,61.18
  Bottom 0.406: v63.52,61.18 68.04,61.18 68.91,60.32 69.7,60.32 70.81,61.43 73.98,61.43 76.14,63.59 76.14,70.39 73.3,73.23 69.72,73.23 69.13,73.81 69.13,81.61 67.74,83 52.78,83 49.96,80.17 49.94,80.17 49.58,79.81 40.93,79.81 COLOR_SENSOR.5
TXD  (via drill 0.41)
  Top 0.406: X1.15 31.21,29.38 v34.82,29.38 | v61.82,61.05 61.97,61.28 62.07,61.38 62.43,61.38 63.34,62.12 64.11,62.1 64.65,61.4 U3.21 | v38.04,29.41 41.12,26.31 48.23,26.31 48.94,25.6 v48.94,18.51 | v46.6,11.45 46.63,11.47 v58.75,11.47
  Bottom 0.406: v61.82,61.05 61.82,14.55 v58.75,11.47 | v34.82,29.38 38.02,29.38 v38.04,29.41 | v48.94,18.51 48.76,18.33 43,18.33 42.15,17.49 FTDI.2 46.6,12.48 v46.6,11.45
TXLED1  (via drill 0.41)
  Top 0.406: U3.22 65.45,62.25 61.08,66.62 61.08,67.12 61.49,67.53 63.75,67.53 66.62,70.4 66.62,72.33 65.45,73.5 v59.38,73.5 | v53.16,73.12 R6.1
  Bottom 0.406: v59.38,73.5 57.25,73.5 56.69,72.94 53.34,72.94 v53.16,73.12
VBAT  (via drill 1.52)
  Top 0.406: C1.+ 14.74,35.01 15.03,35.3 | C6.+ 14.77,39.88 15.03,39.62
  Top 0.635: U4.P$6 17.19,55.23 17.06,55.11
  Top 1.016: 38.74,51.89 D21.C 36.2,51.89 35.61,51.3 35.61,46.73 34.59,45.71 27.48,45.71 26.72,46.47 26.72,46.53 | 38.74,51.89 40.06,51.89 D5.C 41.86,51.9 42.21,51.55 42.21,46.73 43.48,45.46 48.33,45.46 49.19,46.32 | 38.74,51.89 38.91,52.06 | D23.C 26.72,48.25 26.72,46.53 | 49.19,46.32 D3.C | 26.72,46.53 26.74,46.5 15.13,46.5 15.03,46.6 | C10.+ 63.33,42.38 C3.+ 63.43,43.19 60.3,46.32 49.19,46.32
  Top 1.422: D8.A 24.39,18.95 22.79,17 15.08,17.01 15.11,17.01 15.11,4.26
  Top 1.524: 15.08,17.01 15.03,35.3 15.03,39.62 15.03,46.6 15.03,51.3 17.06,53.33 17.06,55.11 | v10.79,4.26 15.11,4.26 v21.46,4.26
  Bottom 1.524: v21.46,4.26 v10.79,4.26
VIN  (via drill 0.41)
  Top 0.508: D7.A v24.38,25.98
  Bottom 0.406: FTDI.4 37.07,17.2 35.81,18.46 29.1,18.46 28.29,19.27 28.29,25.71 28.03,25.98
  Bottom 0.508: v24.38,25.98 28.03,25.98
VUSB  (via drill 0.41)
  Top 0.406: U3.2 v57.68,68.44 v57.68,68.45 | v57.68,66.34 57.68,64.81 57.63,64.76 | 57.63,64.76 57.3,64.43 U3.7 | 57.63,64.76 57.63,61.26 v55.95,59.58 | v33.24,9.95 34.9,9.95 36.04,8.81 U$4.VBUS | v52.6,53.94 55.37,56.71 v55.95,56.71
  Bottom 0.406: v57.68,68.45 v57.68,66.34 | v55.95,59.58 v55.95,56.71 | v52.6,53.94 52.57,53.94 51.84,53.21 51.84,48.63 54.12,46.35 54.12,45.13 60.93,38.32 60.93,15.49 55.37,9.92 33.27,9.92 v33.24,9.95

### Text on the board
bNames: Felix Heibeck | Jiaojiao Xu | Mariokardt v1 | 07/28/2016
Document: TODO